# Altium schematic sheet Power Budget.SchDoc
size A; SheetNumber: 2; SheetTotal: 2
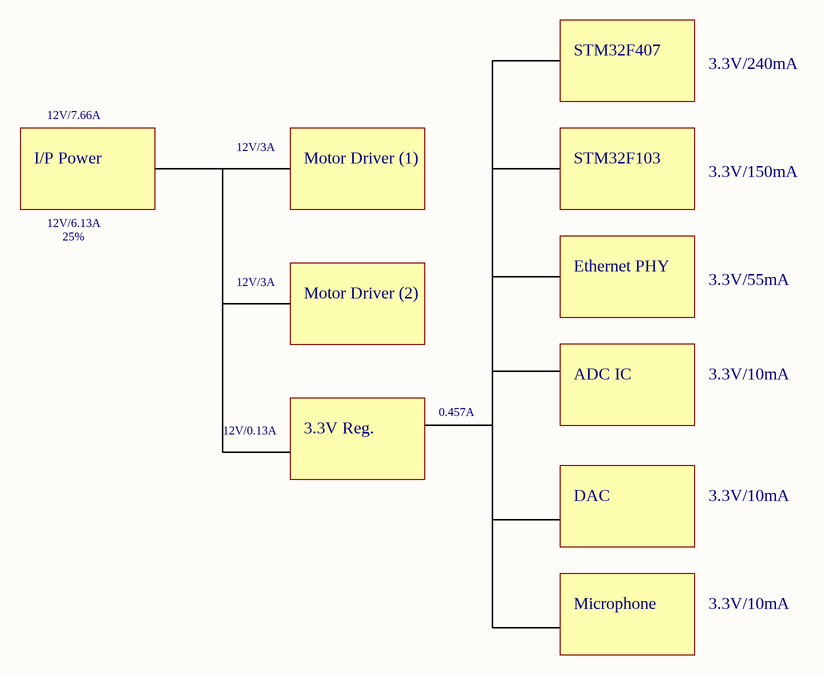
[diagram p0: Power Budget.SchDoc]

## Notes on the sheet
- STM32F407
- 3.3V/240mA
- 12V/7.66A
- 12V/3A
- I/P Power
- 12V/6.13A
- Motor Driver (1)
- STM32F103
- 3.3V/150mA
- 25%
- Ethernet PHY
- 3.3V/55mA
- Motor Driver (2)
- 0.457A
- ADC IC
- 3.3V/10mA
- 12V/0.13A
- 3.3V Reg.
- DAC
- Microphone